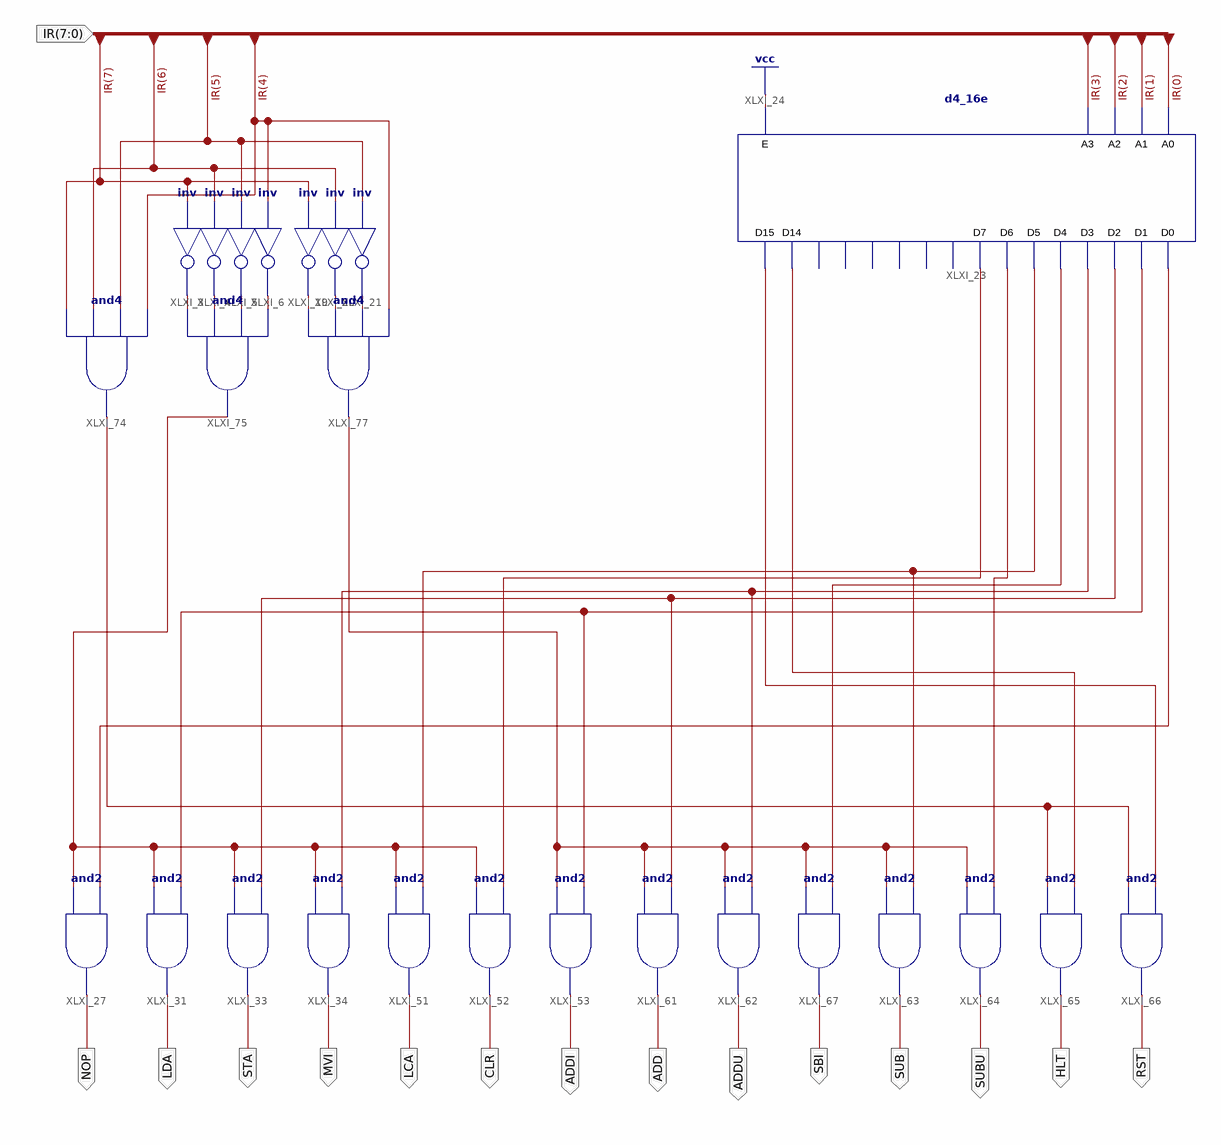
[diagram p0: schematic sheet 1]
// Xilinx ISE schematic instruction.sch (spartan3e) as structural Verilog: 25 symbols, 15 ports
module instruction (
  input  [7:0] IR,
  output NOP,
  output LDA,
  output STA,
  output MVI,
  output LCA,
  output CLR,
  output ADDI,
  output ADD,
  output ADDU,
  output SBI,
  output SUB,
  output SUBU,
  output HLT,
  output RST
);

  wire XLXN_9, XLXN_10, XLXN_11, XLXN_12, XLXN_21, XLXN_22, XLXN_23, XLXN_104, XLXN_117, XLXN_118, XLXN_119,
       XLXN_120, XLXN_122, XLXN_123, XLXN_124, XLXN_125, XLXN_126, XLXN_127, XLXN_128, XLXN_129;

  not XLXI_3 (XLXN_9, IR[7]);
  not XLXI_4 (XLXN_10, IR[6]);
  not XLXI_5 (XLXN_11, IR[5]);
  not XLXI_6 (XLXN_12, IR[4]);
  not XLXI_19 (XLXN_21, IR[7]);
  not XLXI_20 (XLXN_22, IR[6]);
  not XLXI_21 (XLXN_23, IR[5]);
  d4_16e XLXI_23 (
    .A0(IR[0]), .A1(IR[1]), .A2(IR[2]), .A3(IR[3]), .E(1'b1), .D0(XLXN_117), .D1(XLXN_126), .D14(XLXN_119),
    .D15(XLXN_118), .D2(XLXN_125), .D3(XLXN_124), .D4(XLXN_123), .D5(XLXN_122), .D6(XLXN_120), .D7(XLXN_127));  // open: D10, D11, D12, D13, D8, D9
  and XLXI_27 (NOP, XLXN_104, XLXN_117);
  and XLXI_31 (LDA, XLXN_104, XLXN_126);
  and XLXI_33 (STA, XLXN_104, XLXN_125);
  and XLXI_34 (MVI, XLXN_104, XLXN_124);
  and XLXI_51 (LCA, XLXN_104, XLXN_122);
  and XLXI_52 (CLR, XLXN_104, XLXN_127);
  and XLXI_53 (ADDI, XLXN_128, XLXN_126);
  and XLXI_61 (ADD, XLXN_128, XLXN_125);
  and XLXI_62 (ADDU, XLXN_128, XLXN_124);
  and XLXI_63 (SUB, XLXN_128, XLXN_122);
  and XLXI_64 (SUBU, XLXN_128, XLXN_120);
  and XLXI_65 (HLT, XLXN_129, XLXN_119);
  and XLXI_66 (RST, XLXN_129, XLXN_118);
  and XLXI_67 (SBI, XLXN_128, XLXN_123);
  and XLXI_74 (XLXN_129, IR[7], IR[6], IR[5], IR[4]);
  and XLXI_75 (XLXN_104, XLXN_9, XLXN_10, XLXN_11, XLXN_12);
  and XLXI_77 (XLXN_128, XLXN_21, XLXN_22, XLXN_23, IR[4]);
endmodule
